# Altium schematic sheet MASTER_GPIO.SchDoc
size B
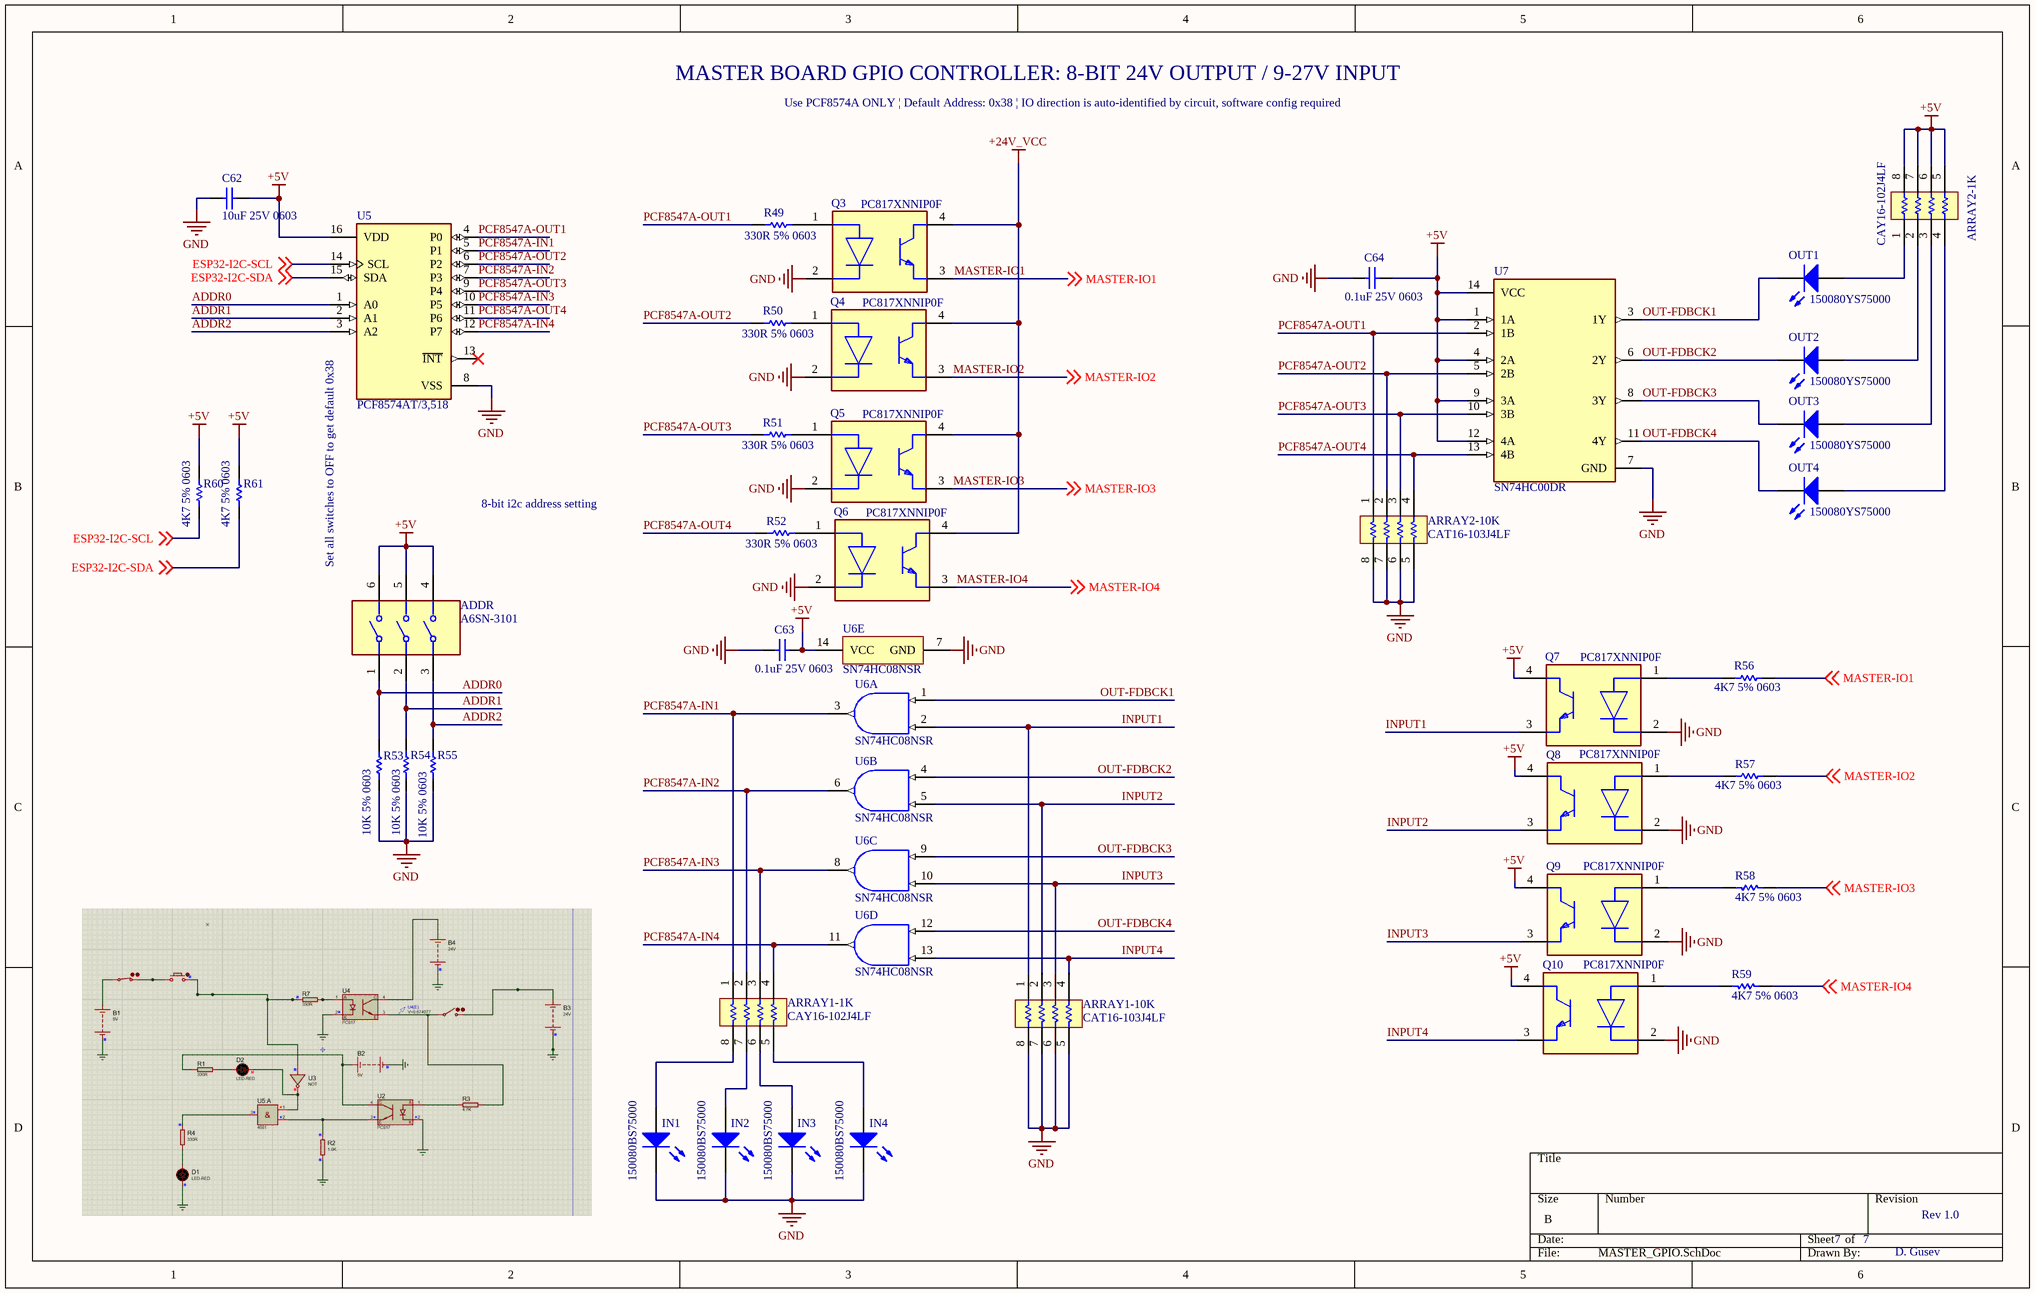
[diagram p0: MASTER_GPIO.SchDoc]

## Parts
ADDR  A6SN-3101  [FP-A6SN-3101-MFG]
ARRAY1-1K  CAY16-102J4LF  [BOUR-CAY16-J4_V]
ARRAY1-10K  CAT16-103J4LF  [BOUR-CAT16-103J4LF_L]
ARRAY2-1K  CAY16-102J4LF  [BOUR-CAY16-J4_V]
ARRAY2-10K  CAT16-103J4LF  [BOUR-CAT16-103J4LF_L]
C62  10uF 25V 0603  [CAPC1608X100X20VL10T10]
C63  0.1uF 25V 0603  [CAPC1608X90X35LL10T15]
C64  0.1uF 25V 0603  [CAPC1608X90X35LL10T15]
IN1  150080BS75000  [0805_A]
IN2  150080BS75000  [0805_A]
IN3  150080BS75000  [0805_A]
IN4  150080BS75000  [0805_A]
OUT1  150080YS75000  [0805_A]
OUT2  150080YS75000  [0805_A]
OUT3  150080YS75000  [0805_A]
OUT4  150080YS75000  [0805_A]
Q3  PC817XNNIP0F  [FP-PC817XNNIP0F-MFG]
Q4  PC817XNNIP0F  [FP-PC817XNNIP0F-MFG]
Q5  PC817XNNIP0F  [FP-PC817XNNIP0F-MFG]
Q6  PC817XNNIP0F  [FP-PC817XNNIP0F-MFG]
Q7  PC817XNNIP0F  [FP-PC817XNNIP0F-MFG]
Q8  PC817XNNIP0F  [FP-PC817XNNIP0F-MFG]
Q9  PC817XNNIP0F  [FP-PC817XNNIP0F-MFG]
Q10  PC817XNNIP0F  [FP-PC817XNNIP0F-MFG]
R49  330R 5% 0603  [RESC1608X55X25NL10T15]
R50  330R 5% 0603  [RESC1608X55X25NL10T15]
R51  330R 5% 0603  [RESC1608X55X25NL10T15]
R52  330R 5% 0603  [RESC1608X55X25NL10T15]
R53  10K 5% 0603  [RESC1608X55X25ML10T15]
R54  10K 5% 0603  [RESC1608X55X25ML10T15]
R55  10K 5% 0603  [RESC1608X55X25ML10T15]
R56  4K7 5% 0603  [RESC1608X55X25LL10T15]
R57  4K7 5% 0603  [RESC1608X55X25LL10T15]
R58  4K7 5% 0603  [RESC1608X55X25LL10T15]
R59  4K7 5% 0603  [RESC1608X55X25LL10T15]
R60  4K7 5% 0603  [RESC1608X55X25LL10T15]
R61  4K7 5% 0603  [RESC1608X55X25LL10T15]
U5  PCF8574AT/3,518  [FP-SOT162-1-MFG]
U6  SN74HC08NSR  [NS0014A_M]  (parts A,B,C,D,E of 5)
U7  SN74HC00DR  [FP-D0014A-MFG]

## Nets
+5V: ADDR.4 ADDR.5 ADDR.6 ARRAY2-1K.5 ARRAY2-1K.6 ARRAY2-1K.7 ARRAY2-1K.8 C62.1 C63.1 C64.1 Q7.4(C) Q8.4(C) Q9.4(C) Q10.4(C) R60.2 R61.2 U5.16(VDD) U6.14(VCC) U7.1(1A) U7.4(2A) U7.9(3A) U7.12(4A) U7.14(VCC)
+24V_VCC: Q3.4(C) Q4.4(C) Q5.4(C) Q6.4(C)
GND: ARRAY1-10K.5 ARRAY1-10K.6 ARRAY1-10K.7 ARRAY1-10K.8 ARRAY2-10K.5 ARRAY2-10K.6 ARRAY2-10K.7 ARRAY2-10K.8 C62.2 C63.2 C64.2 IN1.1(K) IN2.1(K) IN3.1(K) IN4.1(K) Q3.2(C) Q4.2(C) Q5.2(C) Q6.2(C) Q7.2(C) Q8.2(C) Q9.2(C) Q10.2(C) R53.1 R54.1 R55.1 U5.8(VSS) U6.7(GND) U7.7(GND)
ADDR0: ADDR.1 R53.2 U5.1(A0)
ADDR1: ADDR.2 R54.2 U5.2(A1)
ADDR2: ADDR.3 R55.2 U5.3(A2)
ESP32-I2C-SCL: R60.1 U5.14(SCL) ; off-sheet ESP32-I2C-SCL
ESP32-I2C-SDA: R61.1 U5.15(SDA) ; off-sheet ESP32-I2C-SDA
INPUT1: ARRAY1-10K.1 Q7.3(E) U6.2(1B)
INPUT2: ARRAY1-10K.2 Q8.3(E) U6.5(2B)
INPUT3: ARRAY1-10K.3 Q9.3(E) U6.10(3B)
INPUT4: ARRAY1-10K.4 Q10.3(E) U6.13(4B)
MASTER-IO1: Q3.3(E) R56.2 ; off-sheet MASTER-IO1
MASTER-IO2: Q4.3(E) R57.2 ; off-sheet MASTER-IO2
MASTER-IO3: Q5.3(E) R58.1 ; off-sheet MASTER-IO3
MASTER-IO4: Q6.3(E) R59.1 ; off-sheet MASTER-IO4
OUT-FDBCK1: OUT1.1(K) U6.1(1A) U7.3(1Y)
OUT-FDBCK2: OUT2.1(K) U6.4(2A) U7.6(2Y)
OUT-FDBCK3: OUT3.1(K) U6.9(3A) U7.8(3Y)
OUT-FDBCK4: OUT4.1(K) U6.12(4A) U7.11(4Y)
PCF8547A-IN1: ARRAY1-1K.1 U5.5(P1) U6.3(1Y)
PCF8547A-IN2: ARRAY1-1K.2 U5.7(P3) U6.6(2Y)
PCF8547A-IN3: ARRAY1-1K.3 U5.10(P5) U6.8(3Y)
PCF8547A-IN4: ARRAY1-1K.4 U5.12(P7) U6.11(4Y)
PCF8547A-OUT1: ARRAY2-10K.1 R49.1 U5.4(P0) U7.2(1B)
PCF8547A-OUT2: ARRAY2-10K.2 R50.1 U5.6(P2) U7.5(2B)
PCF8547A-OUT3: ARRAY2-10K.3 R51.1 U5.9(P4) U7.10(3B)
PCF8547A-OUT4: ARRAY2-10K.4 R52.1 U5.11(P6) U7.13(4B)
NetARRAY1-1K_5: ARRAY1-1K.5 IN4.2(A)
NetARRAY1-1K_6: ARRAY1-1K.6 IN3.2(A)
NetARRAY1-1K_7: ARRAY1-1K.7 IN2.2(A)
NetARRAY1-1K_8: ARRAY1-1K.8 IN1.2(A)
NetARRAY2-1K_1: ARRAY2-1K.1 OUT1.2(A)
NetARRAY2-1K_2: ARRAY2-1K.2 OUT2.2(A)
NetARRAY2-1K_3: ARRAY2-1K.3 OUT3.2(A)
NetARRAY2-1K_4: ARRAY2-1K.4 OUT4.2(A)
NetQ3_1: Q3.1(A) R49.2
NetQ4_1: Q4.1(A) R50.2
NetQ5_1: Q5.1(A) R51.2
NetQ6_1: Q6.1(A) R52.2
NetQ7_1: Q7.1(A) R56.1
NetQ8_1: Q8.1(A) R57.1
NetQ9_1: Q9.1(A) R58.2
NetQ10_1: Q10.1(A) R59.2

Not connected (* = marked no-connect by the designer): U5 13(~{INT})*

## Notes on the sheet
- MASTER BOARD GPIO CONTROLLER: 8-BIT 24V OUTPUT / 9-27V INPUT
- Use PCF8574A ONLY | Default Address: 0x38 | IO direction is auto-identified by circuit, software config required
- Set all switches to OFF to get default 0x38
- 8-bit i2c address setting
- 7
- Rev 1.0
- D. Gusev

## Library data of the parts
ADDR = CMP-08827-000007-1: SWITCH SLIDE DIP SPST 25MA 24V; Manufacturer: Omron Electronics Inc-EMC Div; Electromechanical Life: 1000Cycles; Contact Resistance: 200mΩ; Standoff Height: 0.7mm; Number Of Circuits: 3; Device Class L2: Switches; Device Class L3: DIP Switches; Ambient Temperature Range High: +85°C; RoHS: TRUE; Temperature Range High: +85°C; Ambient Temperature Range Low: -30°C; ComponentLink2URL: https://omronfs.omron.com/en_US/ecb/products/pdf/en-a6sn.pdf; Category: Switch; Temperature Range Low: -30°C; Digikey Description: SWITCH SLIDE DIP SPST 25MA 24V; Package: A6SN-3101; Mouser Description: DIP Switches / SIP Switches 3P Knife-Edge, 2.3mm Slide SMT Flat-Act; Device Class L1: Electromechanical; Current Rating: 25mA; Lead Free: Yes; ComponentLink2Description: Datasheet; Throw Configuration: SPST; Voltage Rating Dc: 24V; Height: 4.55mm; Octopart: https://octopart.com/a6sn-3101-omron-55396000; Automotive: No; Manufacturer Part Number: A6SN-3101; Temperature: -30°C to +85°C
ARRAY1-1K ARRAY2-1K = CMP-1747-00007-1: Chip Resistor Array, 1 KOhm, +/- 5%, 62.5 mW, -55 to 125 degC, 8-Pin SMD, RoHS, Tape and Reel; Power Rating: 100 mW; Tolerance: 1%; Voltage Rating (DC): 50 V; Resistance: 330 Ohm; Case\Package: 0603; RoHSCompliant: true; Case Code (Metric): 1608; Pins: 2; PackageDescription: 8-Pin Surface Mount Device, Body 1.6 x 3.2 mm, Pitch 0.8 mm; Height: 0.45 mm; Min Operating Temperature: -55 degC; ComponentLink1URL: http://www.bourns.com/; Case Code (Imperial): 0603; Packaging: Tape and Reel; PackageReference: CAY16-J4; ComponentLink1Description: Manufacturer URL; ComponentLink2Description: Datasheet; Length: 1.6 mm; Width: 0.8 mm; Max Operating Temperature: 155 degC; Mount: Surface Mount; DatasheetVersion: Sep-14; Voltage Rating: 50 V; REACH SVHC: No SVHC; ComponentLink2URL: http://www.bourns.com/pdfs/CATCAY.pdf; Package Quantity: 5000
ARRAY1-10K ARRAY2-10K = CMP-2000-06067-1: CAT / CAY 16 Series - Chip Resistor Array, 10 KOhm, +/- 5%, 50 V, -55 to 125 degC, 8-Pin SMD, RoHS, Tape and Reel; Manufacturer: Bourns; Power Per Element: 62.5mW; Online Catalog: CAT16Series; Resistance (Ohms): 10k; Number of Resistors: 4; EDA / CAD Models: DownloadfromAcceleratedDesigns; Temperature Coefficient: ±200ppm/°C; Circuit Type: Isolated; Other Names: CAT16-103J4LFDKR; Package Reference: CAT16-103J4LF; Datasheet Version: 09/2014; Series: CAT16; Manufacturer URL: http://www.bourns.com/; Mounting Type: SurfaceMount; Datasheet URL: http://www.mouser.com/ds/2/54/ATCAY-777361.pdf; Category: Resistors; Height: 0.024"(0.60mm); Mounting Technology: SurfaceMount; Applications: -; Size / Dimension: 0.126"Lx0.061"W(3.20mmx1.55mm); Packaging: Digi-Reel®; Package / Case: 1206(3216Metric),Concave,LongSideTerminals; Supplier Device Package: 1206; RoHS Information: CAT16MaterialDeclaration; Number of Pins: 8; Family: ResistorNetworks,Arrays; Standard Package: 1; Package Description: 8-Pin Surface Mount Device, Body 3.2 x 1.55 mm, Pitch 0.8 mm; Operating Temperature: -55°C~125°C; Tolerance: ±5%
C62 = CMP-2000-05442-1: Chip Capacitor, 10 uF, +/- 20%, 25 V, -55 to 85 degC, 0603 (1608 Metric), RoHS, Tape and Reel; Manufacturer: TDK; PCN Part Number: MLCCPartNumberChange30/Nov/2012; Other Names: 445-9015-1; Capacitance: 10µF; Design Resources: 20WNon-IsolatedBuckLEDDriverUsingPLLNK460KG; Kits: 445-9014-KIT-ND-KITMLCC100PF-22UF060310-50V; Product Training Modules: SEAT,CCV,andTVCLDesignToolsGuidetoReplacinganElectrolyticCapacitorwithanMLCC; Online Catalog: CSeries,GeneralPurpose; Temperature Coefficient: X5R; Package Description: 2-Pin Surface Mount Device, Body 1.6 x 0.8 mm; Lead Style: -; Datasheet URL: http://download.siliconexpert.com/pdfs/2016/2/22/9/40/35/949/tdk_/manual/8010476609961980104703407078c1608x5r1e106m080ac.pdf.pdf; Category: Capacitors; Package / Case: 0603(1608Metric); Packaging: CutTape(CT); Series: C; Features: -; Family: CeramicCapacitors; Standard Package: 1; Tolerance: ±20%; Operating Temperature: -55degC~85degC; Mounting Type: SurfaceMount,MLCC; Ratings: -; Size / Dimension: 0.063"Lx0.031"W(1.60mmx0.80mm); Applications: GeneralPurpose; Package Reference: 1608; RoHS Information: RoHSCertificate-MLCC; Manufacturer URL: http://www.tdk.com/; Datasheet Version: Feb-16; Voltage - Rated: 25V; Height - Seated (Max): -; Thickness (Max): 0.039"(1.00mm); Lead Spacing: -
C63 C64 = CMP-2006-02868-1: Part Number: GRM188R71E104KA01D; Manufacturer: Murata
IN1-IN4 = CMP-1426-00008-1: SMD mono-color Chip LED, WL-SMCW, Blue; Manufacturer: Wuerth Elektronik; Color: Blue; ComponentLink2URL: http://katalog.we-online.com/led/datasheet/150080BS75000.pdf; ComponentLink1URL: http://www.we-online.com; ComponentLink2Description: Datasheet; PackageReference: 0805_A; ComponentLink1Description: Manufacturer URL; PartNumber: 150080BS75000
OUT1-OUT4 = CMP-1426-00012-1: SMD mono-color Chip LED, WL-SMCW, Yellow; Manufacturer: Wuerth Elektronik; Color: Yellow; ComponentLink1URL: http://www.we-online.com; PackageReference: 0805_A; ComponentLink2URL: http://katalog.we-online.com/led/datasheet/150080YS75000.pdf; ComponentLink1Description: Manufacturer URL; ComponentLink2Description: Datasheet; PartNumber: 150080YS75000
Q3-Q10 = CMP-65434-000005-1: OPTOISOLATOR 5KV TRANS 4SMD; Reverse Breakdown Voltage: 6V; Output Current per Channel: 30mA; Power Dissipation: 200mW; Collector-emitter Voltage-Max: 200mV; Max Output Voltage: 80V; Input Current: 50mA; Forward Voltage: 1.4V; Fall Time: 18000ns; Number of Elements: 1; Input Type: DC; Packaging: Tape and Reel; RoHS Compliant: Yes; Contact Plating: Copper; Min Operating Temperature: -30°C; Collector Emitter Saturation Voltage: 200mV; Max Input Current: 50mA; Radiation Hardening: No; Max Collector Current: 50mA; Case/Package: SMD/SMT; Mount: Surface Mount; Output Voltage: 80V; Forward Current: 50mA; Max Power Dissipation: 200mW; Collector Emitter Voltage (VCEO): 80V; Number of Channels: 1; Rise Time: 18000ns; Isolation Voltage: 5kV; Number of Pins: 4; Lead Free: Lead Free; Package Quantity: 2000; Isolation Voltage-Max: 5kV; Max Operating Temperature: 100°C
R49-R52 = CMP-1659-00020-2: Chip Resistor, 330 Ohm, +/- 1%, 0.1 W, -55 to 155 degC, 0603 (1608 Metric), RoHS, Tape and Reel; Tolerance: 10%; ESR: 800 mohm; Voltage Rating (DC): 16 V; Capacitance: 47 uF; Length: 7.3 mm; ComponentLink1URL: http://www.yageo.com/; Packaging: Tape and Reel; Pins: 2; ComponentLink1Description: Manufacturer URL; Case Code (Imperial): 2917; REACH SVHC: No SVHC; Width: 4.3 mm; ComponentLink2Description: Datasheet; Voltage Rating: 16 V; RoHSCompliant: True; Max Operating Temperature: 125degC; ComponentLink2URL: http://www.yageo.com/documents/recent/PYu-RC_Group_51_RoHS_L_04.pdf; Min Operating Temperature: -55degC; Case/Package: 2917; Radiation Hardening: No; DatasheetVersion: Rev. 4, 02/2016; Mount: Surface Mount; PackageReference: 0603; Package Quantity: 500; Case Code (Metric): 7343; PackageDescription: 2-Pin Surface Mount Device, Body 1.6 x 0.8 mm; Height: 3.1 mm
R53-R55 = CMP-2100-03664-1: Chip Resistor, 10 KOhm, +/- 1%, 01 W, -55 to 155 degC, 0603 (1608 Metric), RoHS, Tape and Reel; Manufacturer: Yageo; Temperature Coefficient: 100ppm/degreesC; Resistance: 10KOhm; Voltage Rating: 75V; Power Rating: 100mW; Voltage Rating (DC): 50V; Composition: ThickFilm; RoHSCompliant: true; Height: 0.45mm; Lead Free: LeadFree; Case Code (Metric): 1608; Case/Package: 0603; Datasheet Version: Rev. 5, 10/2016; Package Reference: 0603; Depth: 0.8mm; Package Description: 2-Pin Surface Mount Device, Body 1.6 x 0.8 mm; Case Code (Imperial): 0603; Packaging: TapeandReel; Termination: SMD/SMT; Lead Pitch: 0.3mm; Width: 0.8mm; Number of Pins: 2; Length: 1.6mm; REACH SVHC: NoSVHC; Military Standard: Not; Max Operating Temperature: 155degC; Min Operating Temperature: -55degC; Manufacturer URL: http://www.yageo.com/; Datasheet URL: http://www.yageo.com/NewPortal/yageodocoutput?fileName=/pdf/R-Chip/PYu-RC_Group_51_RoHS_L_5.pdf; Weight: 7.1E-05oz; Tolerance: 1%
R56-R61 = CMP-2000-06942-1: Chip Resistor, 4.7 KOhm, +/- 1%, 0.1 W, -55 to 155 degC, 0603 (1608 Metric), RoHS, Tape and Reel; Manufacturer: Yageo; Power Rating: 100mW; Temperature Coefficient: 100PPM/C; Resistance: 4.7kOhms; Voltage Rating: 50V; Package Reference: 0603; Series: RC; Datasheet Version: Rev. 7, 05/2017; Packaging: Reel; Termination Style: SMD/SMT; Datasheet URL: http://www.yageo.com/documents/recent/PYu-RC_Group_51_RoHS_L_7.pdf; Manufacturer URL: http://www.yageo.com/; Package Description: 2-Pin Surface Mount Device, Body 1.6 x 0.8 mm; Case Code - mm: 1608; Case Code - in: 0603; Mounting Technology: SurfaceMount; Operating Temperature Range: -55Cto+155C; Tolerance: 1%; Product: ThickFilmResistorsGeneralPurpose
U5 = CMP-10112-000003-1: IC I/O EXPANDER I2C 8B 16SOIC; Manufacturer: NXP Semiconductors; Interface: I2C,SMBus; Frequency: 100kHz; Nominal Supply Current: 40uA; Max Supply Voltage: 6V; Number Of I/Os: 8; Max Junction Temp: +125°C; Min Supply Voltage: 2.5V; Standoff Height: 0.1mm; RoHS: TRUE; Category: IC; Temperature: -40°C to +85°C; Device Class L3: I/O Expanders; ComponentLink2Description: Datasheet; ComponentLink2URL: https://www.nxp.com/docs/en/data-sheet/PCF8574_PCF8574A.pdf; Digikey Description: IC I/O EXPANDER I2C 8B 16SOIC; Ipc Land Pattern Name: SOIC127P1032X265-16; Mouser Description: PCF8574 Series 2.5 to 6V Remote 8-bit I/O Expander for I2C-bus -SOIC-16; Footprint Url: https://www.nxp.com/docs/en/package-information/SOT162-1.pdf; Lead Free: Yes; Device Class L2: Interface ICs; Ambient Temperature Range Low: -40°C; Temperature Range High: +85°C; Automotive: No; Manufacturer Part Number: PCF8574AT/3,518; Ambient Temperature Range High: +85°C; Height: 2.65mm; Package: SOT162-1; Temperature Range Low: -40°C; Octopart: https://octopart.com/pcf8574at%2F3%2C518-nxp+semiconductors-11541925; Device Class L1: Integrated Circuits (ICs)
U6 = CMP-0777-00307-4: Quadruple 2-Input Positive-AND Gates, NS0014A, LARGE T&R; Manufacturer: Texas Instruments; Technology Family: HC; Schmitt Trigger: No; ICC @ Nom Voltage(Max)(mA): 0.02; Rating: Catalog; Bits(#): 4; Output Type: CMOS; VCC(Max)(V): 6; VCC(Min)(V): 2; tpd @ Nom Voltage(Max)(ns): 28; Voltage(Nom)(V): 5; F @ Nom Voltage(Max)(Mhz): 70; Generic Part Number: SN74HC08; PackageReference: NS0014A; DatasheetVersion: SCLS081F; Input Type: CMOS; Operating Temperature Range(C): -40 to 85
U7 = CMP-1622-00008-3: IC GATE NAND 4CH 2-INP 14SOIC; Number of Bits: 4; Number of Input Lines: 2; Max Supply Voltage: 6V; Operating Supply Voltage: 5V; Min Supply Voltage: 2V; Logic Function: NAND GATE; Low Level Output Current: 5.2mA; Turn-On Delay Time: 23ns; Number of Outputs: 1; Output Current: 25mA; Quiescent Current: 2uA; Schmitt Trigger Input: No; High Level Output Current: -5.2mA; Propagation Delay: 15ns; Radiation Hardening: No; Contact Plating: Tin; Packaging: Tape and Reel; Number of Pins: 14; Max Operating Temperature: 85°C; Mount: Surface Mount; REACH SVHC: No SVHC; Case/Package: SOIC; Package Quantity: 1; Length: 8.65mm; Number of Circuits: 4; Number of Gates: 4; Height: 1.58mm; Min Operating Temperature: -40°C; Weight: 0.004318oz; Number of Output Lines: 1; RoHS Compliant: Yes; Width: 3.91mm; Lead Free: Lead Free; Number of Inputs: 2; Number of Elements: 4